# Altium schematic sheet Connector.SchDoc
size 199 x 139 mm; DocumentNumber: 3; SheetNumber: 3; SheetTotal: 11
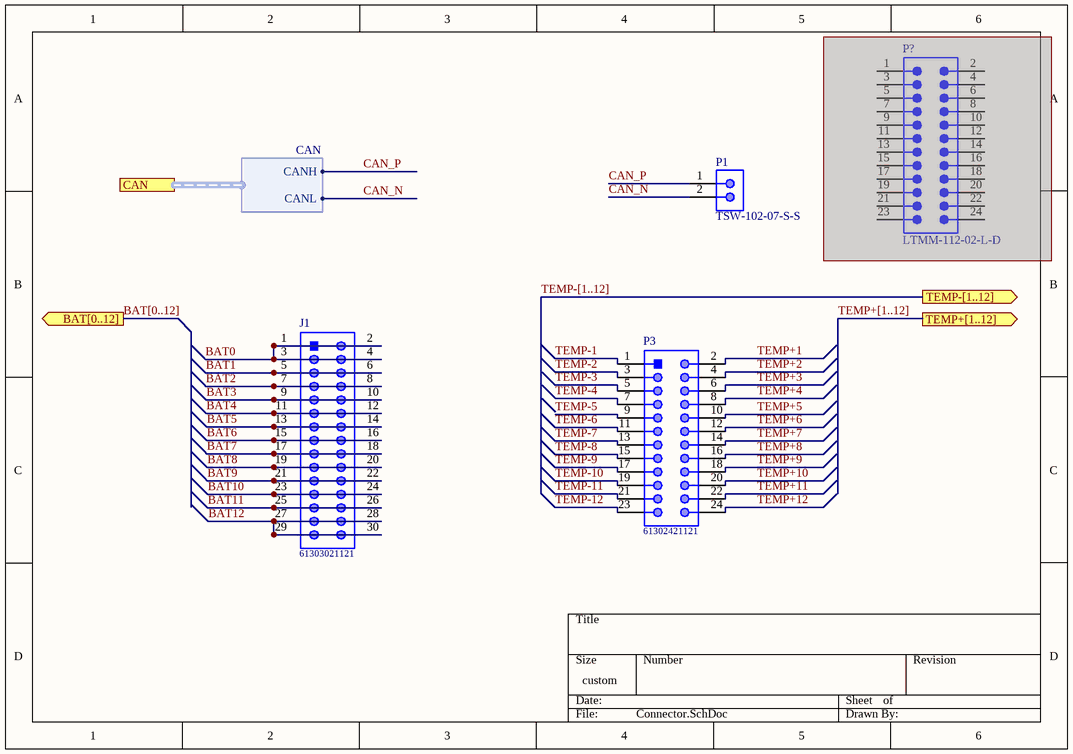
[diagram p0: Connector.SchDoc]

## Parts
J1  61303021121  [61303021121]
P1  TSW-102-07-S-S  [SMTC-TSW-102-07-S-S]
P3  61302421121  [61302421121]
P?  LTMM-112-02-L-D  [SMTC-LTMM-112-02-X-D]  (masked out: inside a compile mask, not in the netlist)

## Ports
BAT[0..12] (out), CAN (harness CAN), TEMP+[1..12] (out), TEMP-[1..12] (out)

## Harnesses
CAN: CANH, CANL

## Nets
BAT0: J1.1 J1.2 J1.3 J1.4
BAT1: J1.5 J1.6
BAT2: J1.7 J1.8
BAT3: J1.9 J1.10
BAT4: J1.11 J1.12
BAT5: J1.13 J1.14
BAT6: J1.15 J1.16
BAT7: J1.17 J1.18
BAT8: J1.19 J1.20
BAT9: J1.21 J1.22
BAT10: J1.23 J1.24
BAT11: J1.25 J1.26
BAT12: J1.27 J1.28 J1.29 J1.30
CAN_N: P1.2 ; port CAN.CANL
CAN_P: P1.1 ; port CAN.CANH
TEMP+1: P3.2
TEMP+2: P3.4
TEMP+3: P3.6
TEMP+4: P3.8
TEMP+5: P3.10
TEMP+6: P3.12
TEMP+7: P3.14
TEMP+8: P3.16
TEMP+9: P3.18
TEMP+10: P3.20
TEMP+11: P3.22
TEMP+12: P3.24
TEMP-1: P3.1
TEMP-2: P3.3
TEMP-3: P3.5
TEMP-4: P3.7
TEMP-5: P3.9
TEMP-6: P3.11
TEMP-7: P3.13
TEMP-8: P3.15
TEMP-9: P3.17
TEMP-10: P3.19
TEMP-11: P3.21
TEMP-12: P3.23

## Buses and harness runs
bus BAT[0..12] = port BAT[0..12]
bus TEMP+[1..12] = port TEMP+[1..12]
bus TEMP-[1..12] = port TEMP-[1..12]

## Library data of the parts
J1 = CMP-1502-01116-1: THT Vertical Pin Header WR-PHD, Pitch 2.54 mm, Dual Row, 30 pins; Manufacturer: Wurth Elektronik; Pin Number: 30; Rated Current: 3A; Working Voltage: 250VAC; Gender: Male; Withstanding Voltage: 500VAC; Contact Resistance: 20mOhm; Pitch: 2.54mm; Datasheet URL: https://katalog.we-online.de/em/datasheet/6130xx21121.pdf; Row Number: Dual; Package Reference: 61303021121; Mounting Technology: THT; Operating Temperature: -40to105degC; Manufacturer URL: http://www.we-online.de; Publisher: WurthElektronik; Packaging: Bag; Part Number: 61303021121; Orientation: Vertical
P1 = CMP-1681-00004-4: Male Header, Pitch 2.54 mm, 1 x 2 Position, Height 8.38 mm, Tail Length 2.54 mm, -55 to 125 degC, RoHS, Bulk; Manufacturer: Samtec; Rows: 1; ComponentLink1URL: http://www.samtec.com/; Contact Finish: Gold; Mounting Technology: Through Hole; PackageReference: TSW-102-07-S-S; RoHSCompliant: true; Pins: 2; Contact Material: Bronze; ComponentLink2Description: Datasheet; Max Operating Temperature: 125 degC; Min Operating Temperature: -55 degC; Height: 8.38 mm; Packaging: Bulk; ComponentLink1Description: Manufacturer URL; PackageDescription: Male Header, Pitch 2.54 mm, 1 x 2 Position, Height 8.38 mm, Tail Length 2.54 mm; Colour: Black; Contact Plating: Gold; Length: 5.08 mm; ComponentLink2URL: http://suddendocs.samtec.com/catalog_english/tsw_th.pdf; DatasheetVersion: 12/2015; Mount: Through Hole; Lead Pitch: 0.1 inch; REACH SVHC: No SVHC; Package Quantity: 1
P3 = CMP-1502-01111-1: THT Vertical Pin Header WR-PHD, Pitch 2.54 mm, Dual Row, 24 pins; Manufacturer: Wurth Elektronik; Contact Resistance: 20mOhm; Pitch: 2.54mm; Pin Number: 24; Withstanding Voltage: 500VAC; Rated Current: 3A; Gender: Male; Working Voltage: 250VAC; Publisher: WurthElektronik; Mounting Technology: THT; Orientation: Vertical; Part Number: 61302421121; Package Reference: 61302421121; Row Number: Dual; Manufacturer URL: http://www.we-online.de; Packaging: Bag; Operating Temperature: -40to105degC; Datasheet URL: https://katalog.we-online.de/em/datasheet/6130xx21121.pdf
P? = CMP-1028-00029-1: Shrouded Header & Stacker, Through-Hole, Vertical, -55 to 125 degC, 2 mm Pitch, 24-Pin, Male, RoHS; Manufacturer: Samtec; Pitch: 2 mm; PackageReference: LTMM-112-02-X-D; Orientation: Vertical; DatasheetVersion: F-214; PackageDescription: LTMM Assembly; ComponentLink1URL: http://www.samtec.com; ComponentLink1Description: Manufacturer URL; Mounting Technology: Through-hole; RoHS: True; ComponentLink2Description: Datasheet; ComponentLink3Description: Package Specification; ComponentLink2URL: http://d2a072wq521u33.cloudfront.net/catalog_english//LTMM.PDF; Temperature Range: -55 to 125 degC; PartNumber: LTMM-112-02-L-D; ComponentLink3URL: http://www.samtec.com/documents/webfiles/cpdf/LTMM-1XX-XX-XX-D-XX-XX-MKT.pdf; PackageVersion: AQ, 5/1992